# Altium project MIni_Quadcopter.PrjPcb
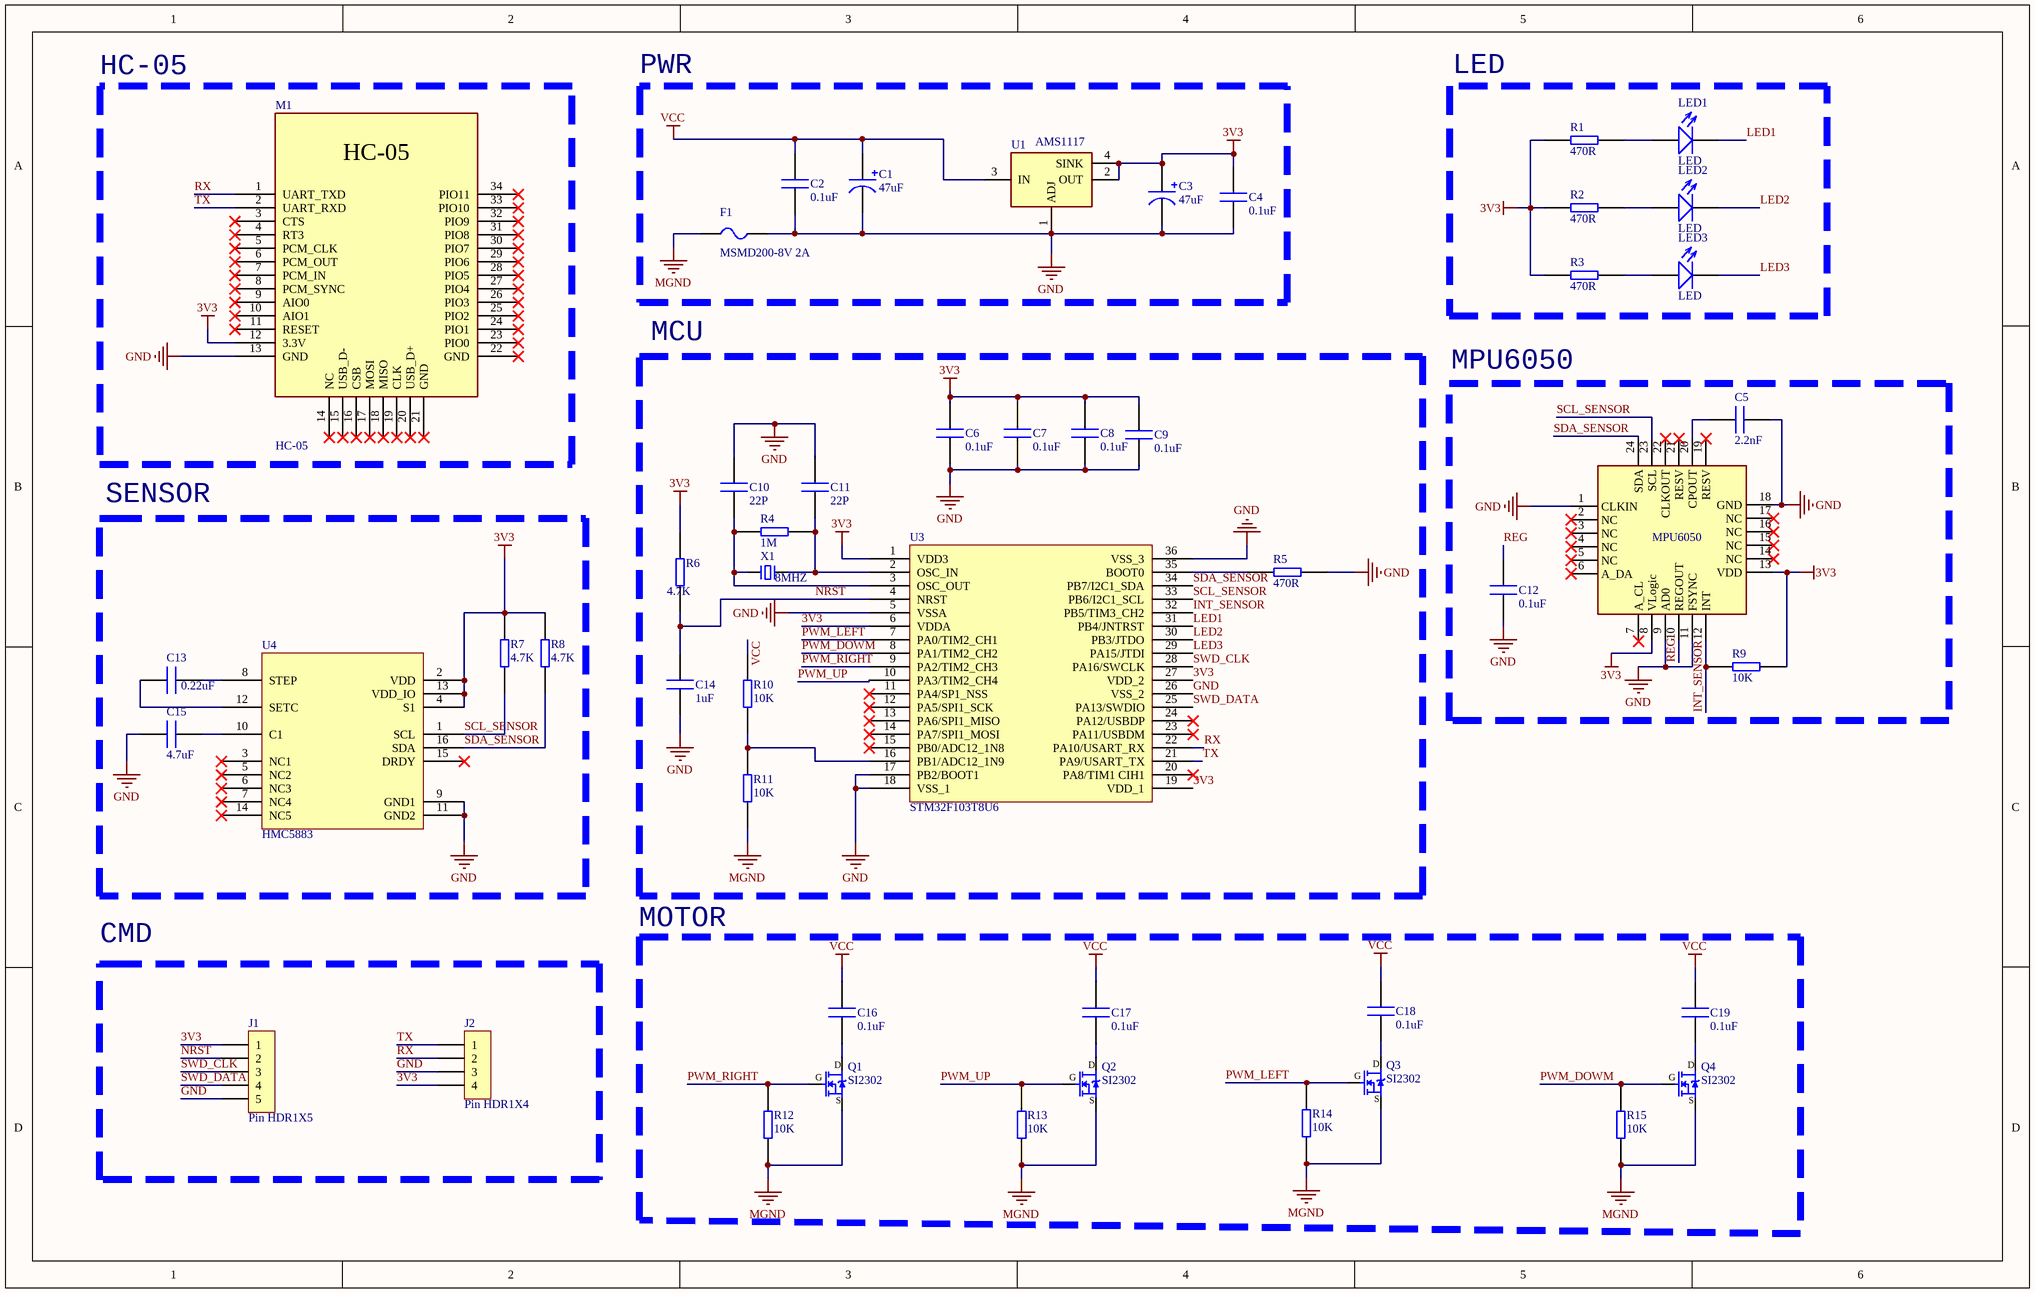
[diagram p0: MIni_Quadcopter.SchDoc]
1 sheet, 50 parts. Net scope: global (net labels, ports and power ports of the same name join across sheets).
Board file: MIni_Quadcopter.PcbDoc

## Sheet MIni_Quadcopter.SchDoc
size 381 x 241 mm; SheetNumber: 1; SheetTotal: 1

### Parts
C1  47uF  [Cap_SMD_5*5.4mm]
C2  0.1uF  [C0603]
C3  47uF  [Cap_SMD_5*5.4mm]
C4  0.1uF  [C0603]
C5  2.2nF  [C0603]
C6  0.1uF  [C0603]
C7  0.1uF  [C0603]
C8  0.1uF  [C0603]
C9  0.1uF  [C0603]
C10  22P  [C0603]
C11  22P  [C0603]
C12  0.1uF  [C0603]
C13  0.22uF  [C0603]
C14  1uF  [C0603]
C15  4.7uF  [C0603]
C16  0.1uF  [C0603]
C17  0.1uF  [C0603]
C18  0.1uF  [C0603]
C19  0.1uF  [C0603]
F1  MSMD200-8V 2A  [FU 1206]
J1  Pin HDR1X5  [Pin HDR1X5/2mm-W]
J2  Pin HDR1X4  [Pin HDR1X4/2.54mm-S]
LED1  LED  [LED_0603]
LED2  LED  [LED_0603]
LED3  LED  [LED_0603]
M1  HC-05  [HC-05]
Q1  SI2302  [SOT_23]
Q2  SI2302  [SOT_23]
Q3  SI2302  [SOT_23]
Q4  SI2302  [SOT_23]
R1  470R  [R0603]
R2  470R  [R0603]
R3  470R  [R0603]
R4  1M  [R0603]
R5  470R  [R0603]
R6  4.7K  [R0603]
R7  4.7K  [R0603]
R8  4.7K  [R0603]
R9  10K  [R0603]
R10  10K  [R0603]
R11  10K  [R0603]
R12  10K  [R0603]
R13  10K  [R0603]
R14  10K  [R0603]
R15  10K  [R0603]
U1  AMS1117  [SOT_223]
U2  MPU6050  [QFN-24]
U3  STM32F103T8U6  [VFQN36_M]
U4  HMC5883  [LGA-16]
X1  8MHZ  [OSC HC-49S]

### Blocks framed on the sheet
HC-05: M1
PWR: C1-C4 F1 U1
LED: LED1-LED3 R1-R3
MCU: C6-C11 C14 R4-R6 R10 R11 U3 X1
SENSOR: C13 C15 R7 R8 U4
CMD: J1 J2
MOTOR: C16-C19 Q1-Q4 R12-R15

### Nets
3V3: C3.1 C4.2 C6.2 C7.2 C8.2 C9.2 J1.1 J2.4 M1.12(3.3V) R1.1 R2.1 R3.1 R6.2 R7.2 R8.2 R9.2 U1.2(OUT) U1.4(SINK) U2.8(VLogic) U2.13(VDD) U3.1(VDD3) U3.6(VDDA) U3.19(VDD_1) U3.27(VDD_2) U4.2(VDD) U4.4(S1) U4.13(VDD_IO)
GND: C1.2 C2.1 C3.2 C4.1 C5.2 C6.1 C7.1 C8.1 C9.1 C10.2 C11.2 C12.2 C14.1 C15.1 F1.2 J1.5 J2.3 M1.13(GND) R5.2 U1.1(ADJ) U2.1(CLKIN) U2.9(AD0) U2.11(FSYNC) U2.18(GND) U3.5(VSSA) U3.17(PB2/BOOT1) U3.18(VSS_1) U3.26(VSS_2) U3.36(VSS_3) U4.9(GND1) U4.11(GND2)
MGND: F1.1 Q1.2(S) Q2.2(S) Q3.2(S) Q4.2(S) R11.2 R12.1 R13.1 R14.1 R15.1
VCC: C1.1 C2.2 C16.2 C17.2 C18.2 C19.2 R10.1 U1.3(IN)
INT_SENSOR: R9.1 U2.12(INT) U3.32(PB5/TIM3_CH2)
LED1: LED1.1 U3.31(PB4/JNTRST)
LED2: LED2.1 U3.30(PB3/JTDO)
LED3: LED3.1 U3.29(PA15/JTDI)
NRST: C14.2 J1.2 R6.1 U3.4(NRST)
PWM_DOWM: Q4.1(G) R15.2 U3.8(PA1/TIM2_CH2)
PWM_LEFT: Q3.1(G) R14.2 U3.7(PA0/TIM2_CH1)
PWM_RIGHT: Q1.1(G) R12.2 U3.9(PA2/TIM2_CH3)
PWM_UP: Q2.1(G) R13.2 U3.10(PA3/TIM2_CH4)
REG: C12.1 U2.10(REGOUT)
RX: J2.2 M1.1(UART_TXD) U3.22(PA10/USART_RX)
SCL_SENSOR: R7.1 U2.23(SCL) U3.33(PB6/I2C1_SCL) U4.1(SCL)
SDA_SENSOR: R8.1 U2.24(SDA) U3.34(PB7/I2C1_SDA) U4.16(SDA)
SWD_CLK: J1.3 U3.28(PA16/SWCLK)
SWD_DATA: J1.4 U3.25(PA13/SWDIO)
TX: J2.1 M1.2(UART_RXD) U3.21(PA9/USART_TX)
NetC5_1: C5.1 U2.20(CPOUT)
NetC10_1: C10.1 R4.1 U3.3(OSC_OUT) X1.1
NetC11_1: C11.1 R4.2 U3.2(OSC_IN) X1.2
NetC13_1: C13.1 U4.8(STEP)
NetC13_2: C13.2 U4.12(SETC)
NetC15_2: C15.2 U4.10(C1)
NetC16_1: C16.1 Q1.3(D)
NetC17_1: C17.1 Q2.3(D)
NetC18_1: C18.1 Q3.3(D)
NetC19_1: C19.1 Q4.3(D)
NetLED1_2: LED1.2 R1.2
NetLED2_2: LED2.2 R2.2
NetLED3_2: LED3.2 R3.2
NetR5_1: R5.1 U3.35(BOOT0)
NetR10_2: R10.2 R11.1 U3.16(PB1/ADC12_1N9)

Not connected (* = marked no-connect by the designer): M1 3(CTS)* 4(RT3)* 5(PCM_CLK)* 6(PCM_OUT)* 7(PCM_IN)* 8(PCM_SYNC)* 9(AIO0)* 10(AIO1)* 11(RESET)* 14(NC)* 15(USB_D-)* 16(CSB)* 17(MOSI)* 18(MISO)* 19(CLK)* 20(USB_D+)* 21(GND)* 22(GND)* 23(PIO0)* 24(PIO1)* 25(PIO2)* 26(PIO3)* 27(PIO4)* 28(PIO5)* 29(PIO6)* 30(PIO7)* 31(PIO8)* 32(PIO9)* 33(PIO10)* 34(PIO11)*; U2 2(NC)* 3(NC)* 4(NC)* 5(NC)* 6(A_DA)* 7(A_CL)* 14(NC)* 15(NC)* 16(NC)* 17(NC)* 19(RESV)* 21(RESV)* 22(CLKOUT)*; U3 11(PA4/SP1_NSS)* 12(PA5/SPI1_SCK)* 13(PA6/SPI1_MISO)* 14(PA7/SPI1_MOSI)* 15(PB0/ADC12_1N8)* 20(PA8/TIM1_CIH1)* 23(PA11/USBDM)* 24(PA12/USBDP)*; U4 3(NC1)* 5(NC2)* 6(NC3)* 7(NC4)* 14(NC5)* 15(DRDY)*

### Notes on the sheet
- MPU6050

### Library data of the parts
C1 C3 = Cap2: 极性电容
C2 C4-C19 = Cap1: 无极电容
F1 = FU: 贴片保险丝
LED1-LED3 = LED: 发光二极管
M1 = HC-05: 串口蓝牙模块; 版权归属: 源创客; BOM名称: 串口蓝牙模块; 学习资源: www.ooocke.com
Q1-Q4 = SI2302: N沟道 20V/3A; BOM名称: 场效应管; 版权归属: 源创客; 学习资源: www.ooocke.com; 描述: N沟道 20V/3A
R1-R15 = Res: 普通电阻
U1 = AMS1117: 稳压电源芯片降压IC
U2 = MPU6050: 六轴传感器
U4 = HMC5883: 地磁传感器
X1 = XTAL-2P: 2脚无源脚晶振